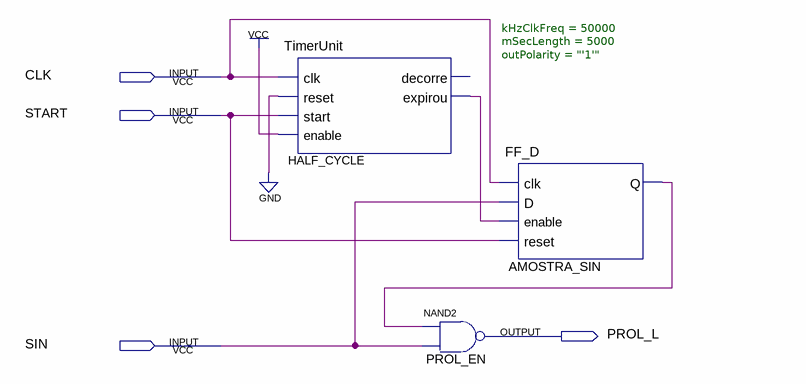
[diagram p0: schematic sheet]
// Quartus schematic Prolonga.bdf as structural Verilog: 3 symbols, 4 pins
module Prolonga (
  input  CLK,
  input  START,
  input  SIN,
  output PROL_L
);

  wire AMOSTRA_SIN_q, HALF_CYCLE_expirou;

  TimerUnit #(.kHzClkFreq(50000), .mSecLength(5000), .outPolarity("'1'")) HALF_CYCLE (
    .clk(CLK), .reset(1'b0), .start(START), .enable(1'b1), .expirou(HALF_CYCLE_expirou));  // open: decorre
  nand PROL_EN (PROL_L, AMOSTRA_SIN_q, SIN);
  FF_D AMOSTRA_SIN (.clk(CLK), .D(SIN), .enable(HALF_CYCLE_expirou), .reset(START), .Q(AMOSTRA_SIN_q));
endmodule
